# EasyEDA schematic SCH_ERV-controller_2026-01-07.json
TITLE: Sheet_1; REV: 1.0; Date: 2025-12-26; Sheet: 1/1; Drawn By: abrowning; Company: Your Company
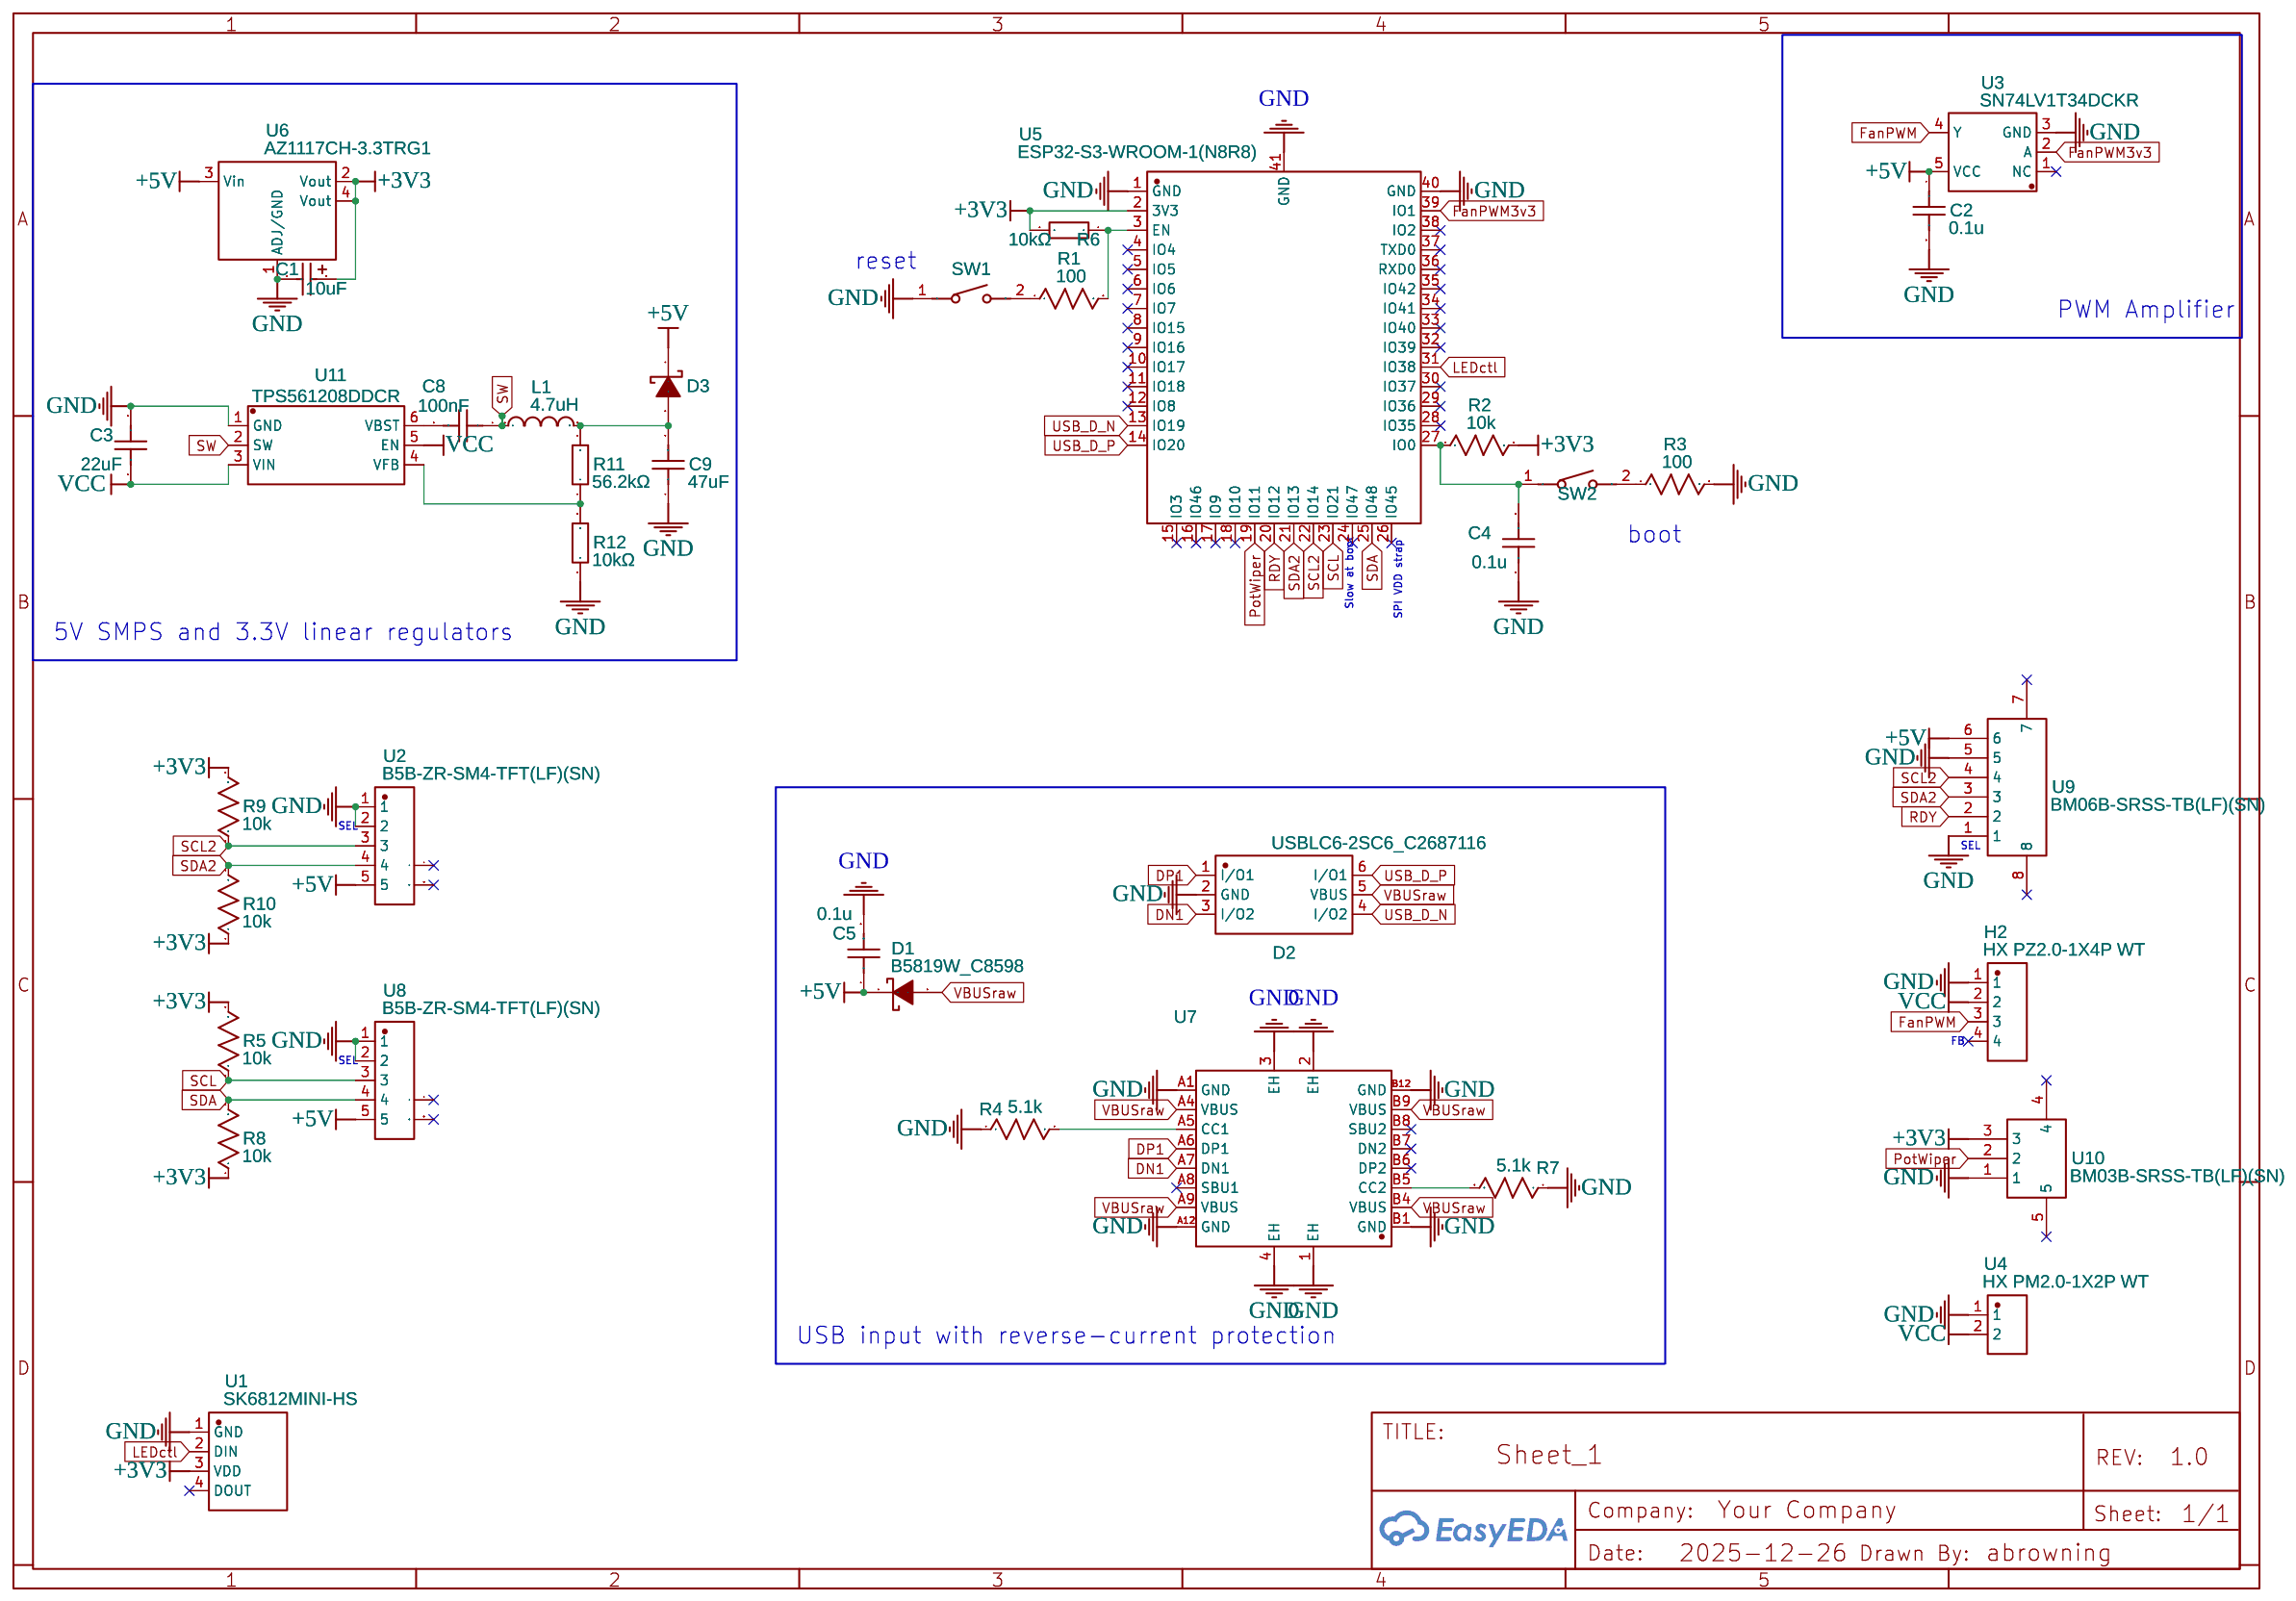
[diagram p0: schematic sheet]

## Parts
C1  10uF  [CAP-SMD_L3.2-W1.6-RD-C7171]
C2  0.1u  [C0603]
C3  22uF  [C0805]
C4  0.1u  [C0603]
C5  0.1u  [C0603]
C8  100nF  [C0402]
C9  47uF  [C1206]
D1  B5819W_C8598  [SOD-123_L2.7-W1.6-LS3.7-RD-1]
D2  USBLC6-2SC6_C2687116  [SOT-23-6_L2.9-W1.6-P0.95-LS2.8-BL]
D3  B5819W_C8598  [SOD-123_L2.7-W1.6-LS3.7-RD-1]
H2  HX PZ2.0-1X4P WT  [HDR-SMD_4P-P2.00-H-M-W6.0-N]
L1  4.7uH  [L1008]
R1  100  [R0603]
R2  10k  [R0603]
R3  100  [R0603]
R4  5.1k  [R0603]
R5  10k  [R0603]
R6  10kΩ  [R0402]
R7  5.1k  [R0603]
R8  10k  [R0603]
R9  10k  [R0603]
R10  10k  [R0603]
R11  56.2kΩ  [R0402]
R12  10kΩ  [R0402]
SW1  TS-1088-AR02016  [SW-SMD_L3.9-W3.0-P4.45]
SW2  TS-1088-AR02016  [SW-SMD_L3.9-W3.0-P4.45]
U1  SK6812MINI-HS  [LED-SMD_4P-L3.5-W3.5-BR_SK6812MINI-HS]
U2  B5B-ZR-SM4-TFT(LF)(SN)  [CONN-SMD_B5B-ZR-SM4-TFT]
U3  SN74LV1T34DCKR  [SC-70-5_L2.1-W1.3-P0.65-LS2.1-BR]
U4  HX PM2.0-1X2P WT  [HDR-SMD_HX-PM2.0-1X2P-WT]
U5  ESP32-S3-WROOM-1(N8R8)  [WIRELM-SMD_ESP32-S3-WROOM-1]
U6  AZ1117CH-3.3TRG1  [SOT-223-3_L6.5-W3.4-P2.30-LS7.0-BR]
U7  TYPE-C 16P LTH6.8  [USB-C-SMD_TYPE-C-16P-LTH6.8]
U8  B5B-ZR-SM4-TFT(LF)(SN)  [CONN-SMD_B5B-ZR-SM4-TFT]
U9  BM06B-SRSS-TB(LF)(SN)  [CONN-SMD-6P-P1.00_BM06B-SRSS-TB-LF-SN]
U10  BM03B-SRSS-TB(LF)(SN)  [CONN-SMD-3P-P1.00_BM03B-SRSS-TB-LF-SN]
U11  TPS561208DDCR  [TSOT-23-6_L2.9-W1.6-P0.95-LS2.8-BR]

## Library data of the parts
C1 = TAJA106K016RNJ: Supplier: LCSC; Manufacturer: Kyocera AVX; Supplier Part: C7171; JLCPCB Part Class: Basic Part
C2 C4 C5 = C_0603_US: Contributor: LCEDA_Lib
C3 = CL21A226MAQNNNE: Supplier: LCSC; Manufacturer: SAMSUNG(三星); Supplier Part: C45783; JLCPCB Part Class: Basic Part
C8 = CL05B104KO5NNNC: Supplier: LCSC; Manufacturer: SAMSUNG(三星); Supplier Part: C1525; JLCPCB Part Class: Basic Part
C9 = CL31A476MPHNNNE: Supplier: LCSC; Manufacturer: SAMSUNG(三星); Supplier Part: C96123; JLCPCB Part Class: Basic Part
D1 D3 = B5819W_C8598: Supplier: LCSC; Manufacturer: CJ(江苏长电/长晶); Manufacturer Part: B5819W SL; Supplier Part: C8598; JLCPCB Part Class: Basic Part
D2 = USBLC6-2SC6_C2687116: Contributor: LCSC; Supplier: LCSC; Supplier Part: C2687116; Manufacturer: UMW(友台半导体); Manufacturer Part: USBLC6-2SC6; JLCPCB Part Class: Extended Part
H2 = HX PZ2.0-1X4P WT: Supplier: LCSC; Supplier Part: C42455215; Manufacturer: hanxia(韩下); Manufacturer Part: HX PZ2.0-1x4P WT; JLCPCB Part Class: Extended Part; Contributor: lcsc
L1 = LQM2HPN4R7MG0L: Supplier: LCSC; Manufacturer: muRata(村田); Supplier Part: C82314; JLCPCB Part Class: Extended Part
R1-R5 R7-R10 = R_0603_US: Contributor: LCEDA_Lib
R6 R12 = 0402WGF1002TCE: Supplier: LCSC; Manufacturer: UNI-ROYAL(厚声); Supplier Part: C25744; JLCPCB Part Class: Basic Part
R11 = RC0402FR-0756K2L: Contributor: LCSC; Supplier: LCSC; Supplier Part: C183355; Manufacturer: YAGEO(国巨); JLCPCB Part Class: Extended Part
SW1 SW2 = TS-1088-AR02016: Contributor: LCSC; Supplier: LCSC; Supplier Part: C720477; Manufacturer: XUNPU(讯普); JLCPCB Part Class: Basic Part
U1 = SK6812MINI-HS: Contributor: LCSC; Supplier: LCSC; Supplier Part: C2922787; Manufacturer: 欧思科光电; JLCPCB Part Class: Extended Part
U2 U8 = B5B-ZR-SM4-TFT(LF)(SN): Contributor: LCSC; Supplier: LCSC; Supplier Part: C471524; Manufacturer: JST; JLCPCB Part Class: Extended Part
U3 = SN74LV1T34DCKR: Contributor: LCSC; Supplier: LCSC; Supplier Part: C78541; Manufacturer: TI(德州仪器); JLCPCB Part Class: Extended Part
U4 = HX PM2.0-1X2P WT: Supplier: LCSC; Supplier Part: C46061752; Manufacturer: hanxia(韩下); Manufacturer Part: HX PM2.0-1x2P WT; Contributor: lcsc; JLCPCB Part Class: Extended Part
U5 = ESP32-S3-WROOM-1(N8R8): Contributor: LCSC; Supplier: LCSC; Supplier Part: C2913201; Manufacturer: ESPRESSIF(乐鑫); Manufacturer Part: ESP32-S3-WROOM-1-N8R8; JLCPCB Part Class: Extended Part
U6 = AZ1117CH-3.3TRG1: Supplier: LCSC; Manufacturer: DIODES(美台); Supplier Part: C92102; JLCPCB Part Class: Extended Part
U7 = TYPE-C 16P LTH6.8: Supplier: LCSC; Supplier Part: C5187468; Manufacturer: SHOU HAN(首韩); JLCPCB Part Class: Extended Part; Contributor: lcsc
U9 = BM06B-SRSS-TB(LF)(SN): Contributor: LCSC; Supplier: LCSC; Supplier Part: C160392; Manufacturer: JST; JLCPCB Part Class: Extended Part
U10 = BM03B-SRSS-TB(LF)(SN): Contributor: LCSC; Supplier: LCSC; Supplier Part: C160389; Manufacturer: JST; JLCPCB Part Class: Extended Part
U11 = TPS561208DDCR: Contributor: LCSC; Supplier: LCSC; Supplier Part: C138335; Manufacturer: TI(德州仪器); JLCPCB Part Class: Extended Part

## Nets
+3V3: C1.1 R2.2 R5.2 R6.2 R8.1 R9.2 R10.1 U1.3(VDD) U5.2(3V3) U6.2(Vout) U6.4(Vout) U10.3
+5V: C2.1 C5.1 D1.1(-) D3.1(-) U2.5 U3.5(VCC) U6.3(Vin) U8.5 U9.6
GND: C1.2 C2.2 C3.2 C4.1 C5.2 C9.1 D2.2(GND) H2.1 R3.2 R4.1 R7.1 R12.1 SW1.1 U1.1(GND) U2.1 U2.2 U3.3(GND) U4.1 U5.1(GND) U5.40(GND) U5.41(GND) U6.1(ADJ/GND) U7.1(EH) U7.2(EH) U7.3(EH) U7.4(EH) U7.A1(GND) U7.A12(GND) U7.B1(GND) U7.B12(GND) U8.1 U8.2 U9.1 U9.5 U10.1 U11.1(GND)
VBUSraw: D1.2(+) D2.5(VBUS) U7.A4(VBUS) U7.A9(VBUS) U7.B4(VBUS) U7.B9(VBUS)
VCC: C3.1 H2.2 U4.2 U11.3(VIN) U11.5(EN)
DN1: D2.3(I/O2) U7.A7(DN1)
DP1: D2.1(I/O1) U7.A6(DP1)
FanPWM: H2.3 U3.4(Y)
FanPWM3v3: U3.2(A) U5.39(IO1)
LEDctl: U1.2(DIN) U5.31(IO38)
PotWiper: U5.19(IO11) U10.2
RDY: U5.20(IO12) U9.2
SCL: R5.1 U5.23(IO21) U8.3
SCL2: R9.1 U2.3 U5.22(IO14) U9.4
SDA: R8.2 U5.25(IO48) U8.4
SDA2: R10.2 U2.4 U5.21(IO13) U9.3
SW: C8.1 L1.1 U11.2(SW)
USB_D_N: D2.4(I/O2) U5.13(IO19)
USB_D_P: D2.6(I/O1) U5.14(IO20)
Net-(C4-2): C4.2 R2.1 SW2.1 U5.27(IO0)
Net-(C8-2): C8.2 U11.6(VBST)
Net-(C9-2): C9.2 D3.2(+) L1.2 R11.2
Net-(R1-1): R1.1 SW1.2
Net-(R1-2): R1.2 R6.1 U5.3(EN)
Net-(R3-1): R3.1 SW2.2
Net-(R4-2): R4.2 U7.A5(CC1)
Net-(R7-2): R7.2 U7.B5(CC2)
Net-(R11-1): R11.1 R12.2 U11.4(VFB)

Not connected (* = marked no-connect by the designer): H2 4*; U1 4(DOUT)*; U2 6* 7*; U3 1(NC)*; U5 4(IO4)* 5(IO5)* 6(IO6)* 7(IO7)* 8(IO15)* 9(IO16)* 10(IO17)* 11(IO18)* 12(IO8)* 15(IO3)* 16(IO46)* 17(IO9)* 18(IO10)* 24(IO47)* 26(IO45)* 28(IO35)* 29(IO36)* 30(IO37)* 32(IO39)* 33(IO40)* 34(IO41)* 35(IO42)* 36(RXD0)* 37(TXD0)* 38(IO2)*; U7 A8(SBU1)* B6(DP2)* B7(DN2)* B8(SBU2)*; U8 6* 7*; U9 7* 8*; U10 4* 5*

## Notes on the sheet
- reset
- PWM Amplifier
- boot
- 5V SMPS and 3.3V linear regulators
- Slow at boot
- SPI VDD strap
- SEL
- SEL
- FB
- SEL
- USB input with reverse-current protection
